# EAGLE design board (EAGLE 7.6.0)
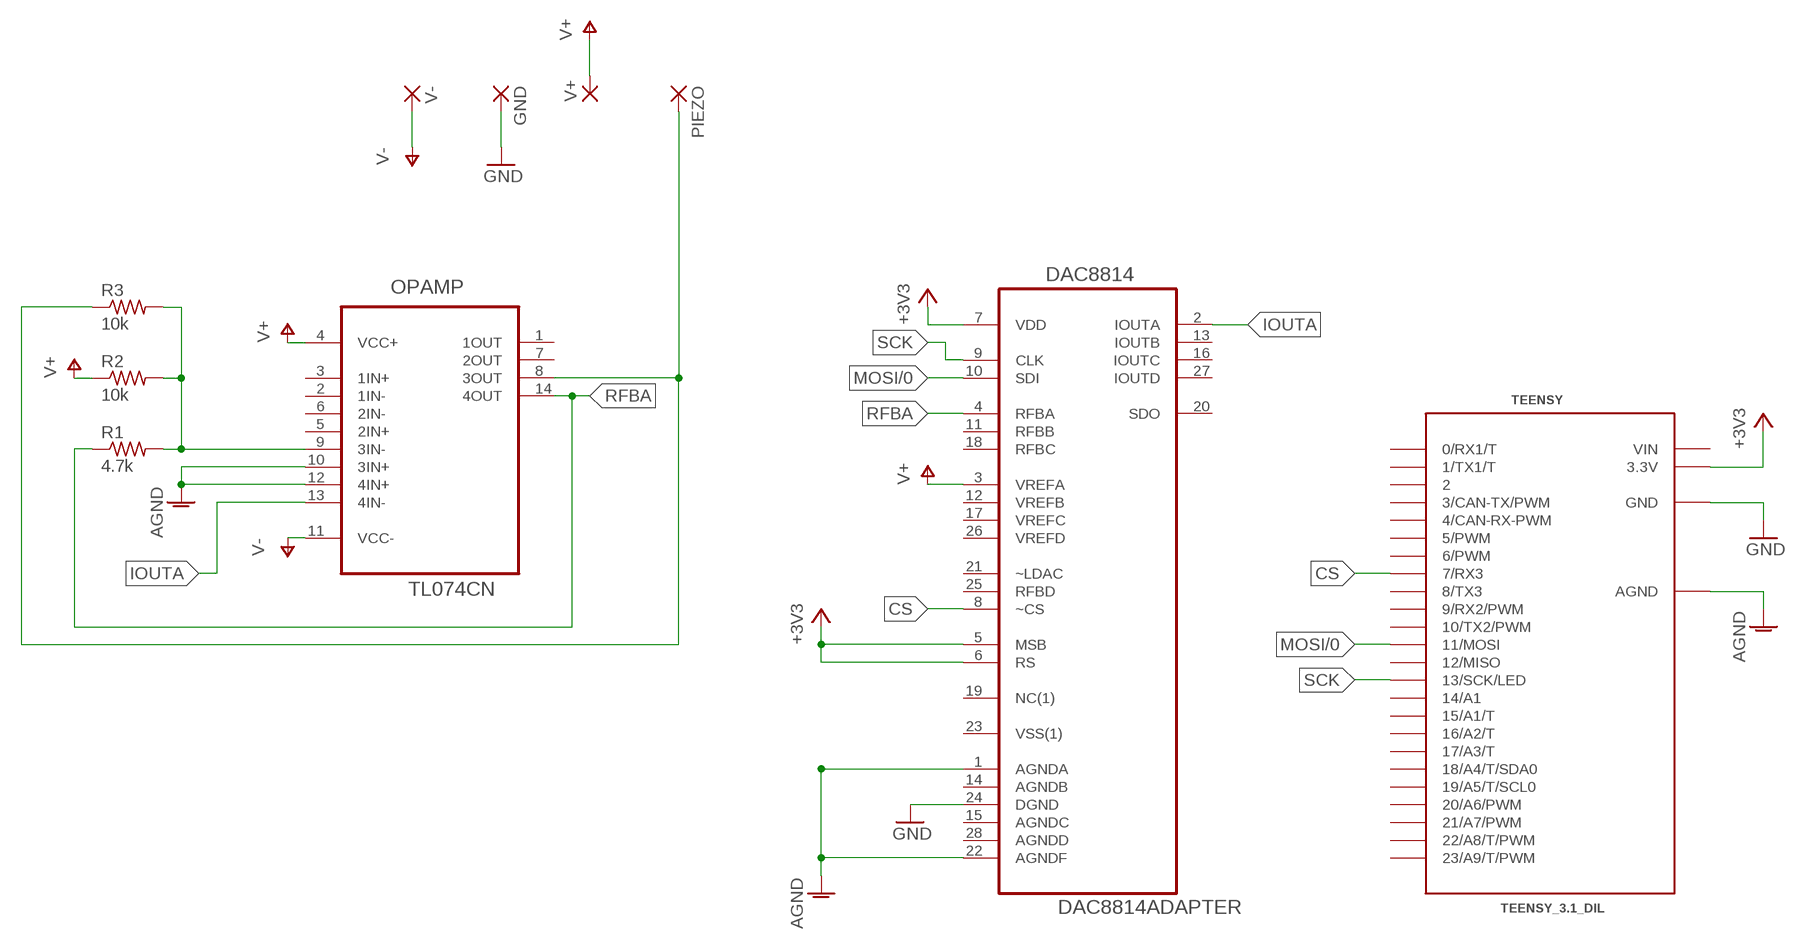
[diagram p0: schematic, sheet 1]

## Parts
DAC8814  DAC8814ADAPTER  [DIL28-6]
GND  1,6/0,8  [1,6/0,8]
OPAMP  TL074CN  [DIP254P762X508-14]
PIEZO  1,6/0,8  [1,6/0,8]
R1  4.7k  R-US_0204/7  [0204/7]
R2  10k  R-US_0204/5  [0204/5]
R3  10k  R-US_0204/5  [0204/5]
TEENSY  TEENSY_3.1_DIL  [TEENSY3-DIL]
V+  1,6/0,8  [1,6/0,8]
V-  1,6/0,8  [1,6/0,8]

## Nets
+3V3: DAC8814.5(MSB) DAC8814.6(RS) DAC8814.7(VDD) TEENSY.3.3V
AGND: DAC8814.1(AGNDA) DAC8814.22(AGNDF) OPAMP.10(3IN+) OPAMP.12(4IN+) TEENSY.AGND
CS: DAC8814.8(~CS) TEENSY.7(7/RX3)
GND: DAC8814.24(DGND) GND.1(P) TEENSY.GND
IOUTA: DAC8814.2(IOUTA) OPAMP.13(4IN-)
MOSI/0: DAC8814.10(SDI) TEENSY.11(11/MOSI)
N$1: OPAMP.9(3IN-) R1.2 R2.2 R3.2
N$5: OPAMP.8(3OUT) PIEZO.1(P) R3.1
RFBA: DAC8814.4(RFBA) OPAMP.14(4OUT) R1.1
SCK: DAC8814.9(CLK) TEENSY.13(13/SCK/LED)
V+: DAC8814.3(VREFA) OPAMP.4(VCC+) R2.1 V+.1(P)
V-: OPAMP.11(VCC-) V-.1(P)
Unconnected: DAC8814.11(RFBB) DAC8814.12(VREFB) DAC8814.13(IOUTB) DAC8814.14(AGNDB) DAC8814.15(AGNDC) DAC8814.16(IOUTC) DAC8814.17(VREFC) DAC8814.18(RFBC) DAC8814.19(NC(1)) DAC8814.20(SDO) DAC8814.21(~LDAC) DAC8814.23(VSS(1)) DAC8814.25(RFBD) DAC8814.26(VREFD) DAC8814.27(IOUTD) DAC8814.28(AGNDD) OPAMP.1(1OUT) OPAMP.2(1IN-) OPAMP.3(1IN+) OPAMP.5(2IN+) OPAMP.6(2IN-) OPAMP.7(2OUT) TEENSY.0(0/RX1/T) TEENSY.1(1/TX1/T) TEENSY.2 TEENSY.3(3/CAN-TX/PWM) TEENSY.4(4/CAN-RX-PWM) TEENSY.5(5/PWM) TEENSY.6(6/PWM) TEENSY.8(8/TX3) TEENSY.9(9/RX2/PWM) TEENSY.10(10/TX2/PWM) TEENSY.12(12/MISO) TEENSY.14/A0(14/A1) TEENSY.15/A1(15/A1/T) TEENSY.16/A2(16/A2/T) TEENSY.17/A3(17/A3/T) TEENSY.18/A4(18/A4/T/SDA0) TEENSY.19/A5(19/A5/T/SCL0) TEENSY.20/A6(20/A6/PWM) TEENSY.21/A7(21/A7/PWM) TEENSY.22/A8(22/A8/T/PWM) TEENSY.23/A9(23/A9/T/PWM)

## Power pins joined to a net without a drawn wire
VIN: TEENSY.VIN

## Library data of the parts
DAC8814 = board:DAC8814ADAPTER: Digital-to-Analog Converter on DIL28 adapter board. Based on components: ic-package.lbr/DIL28 element14/Texas Instruments_By_element14_Batch_1.lbr/DAC8814IBDBT
GND PIEZO V+ V- = wirepad:1,6/0,8: THROUGH-HOLE PAD
OPAMP = Texas Instruments_By_element14_Batch_1:TL074CN: LOW-NOISE JFET-INPUT OPERATIONAL AMPLIFIERS; MPN: TL074CN; OC_FARNELL: 9755934; OC_NEWARK: 60K6990; PACKAGE: PDIP-14; SUPPLIER: Texas Instruments
R1-R3 = resistor:R-US_: RESISTOR, American symbol
TEENSY = Teensy_3_and_LC_Series_Boards_v1.1:TEENSY_3.1_DIL: Teensy 3.1 or 3.2 in a DIL Layout.

## Board
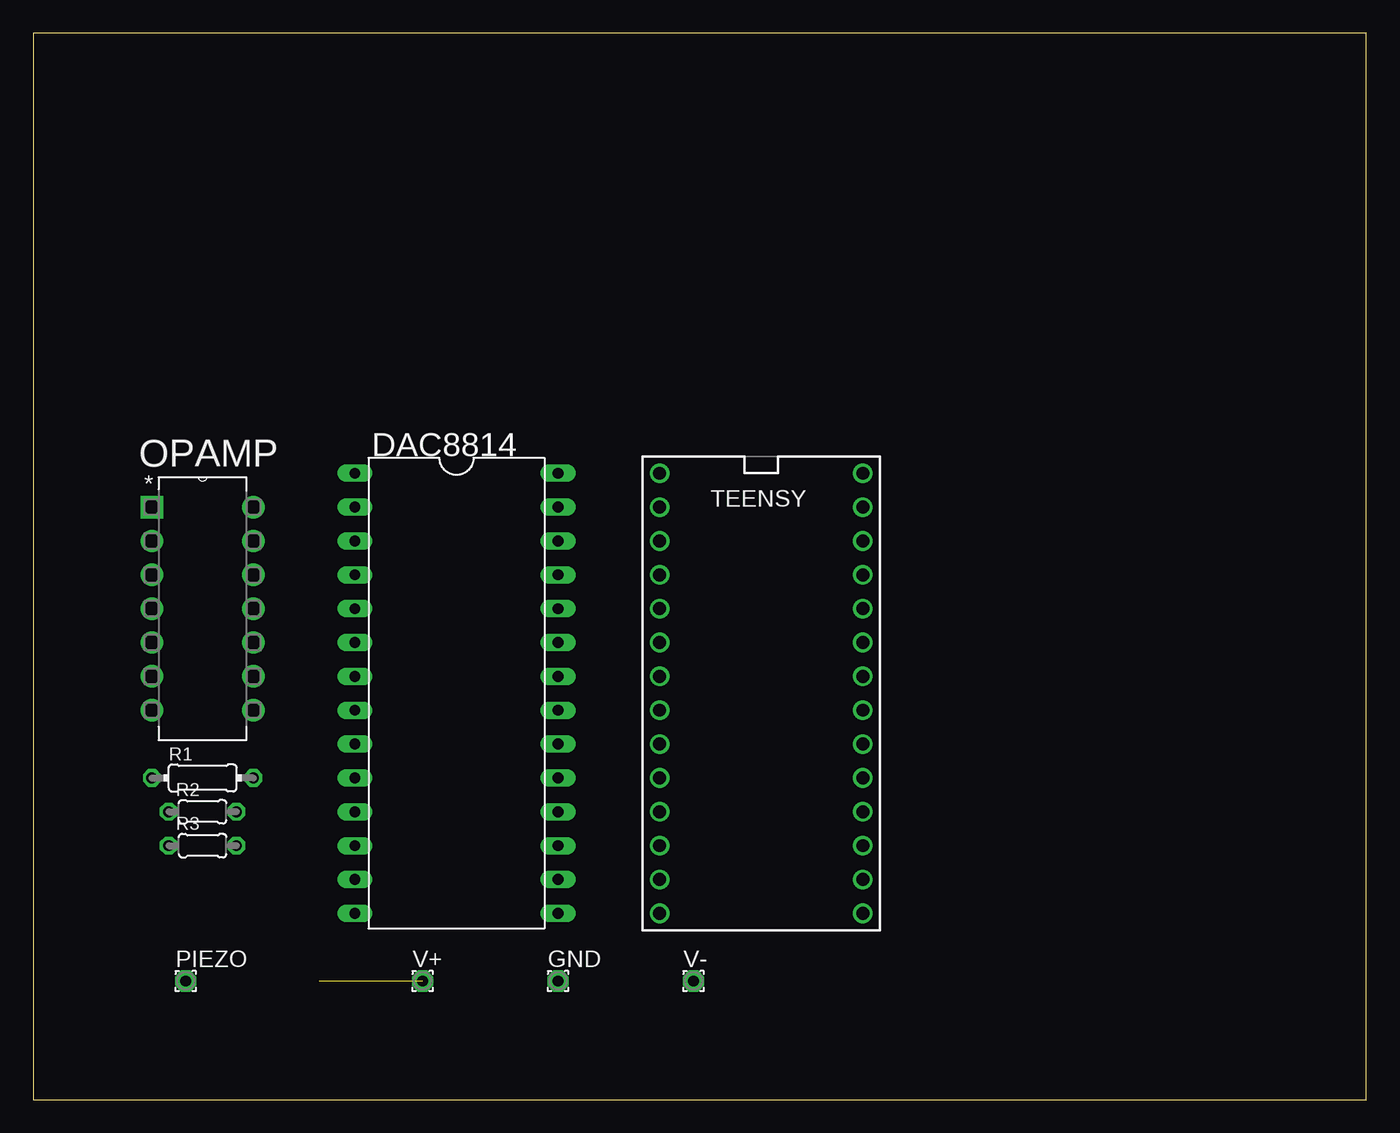
[diagram p1: board, top side]
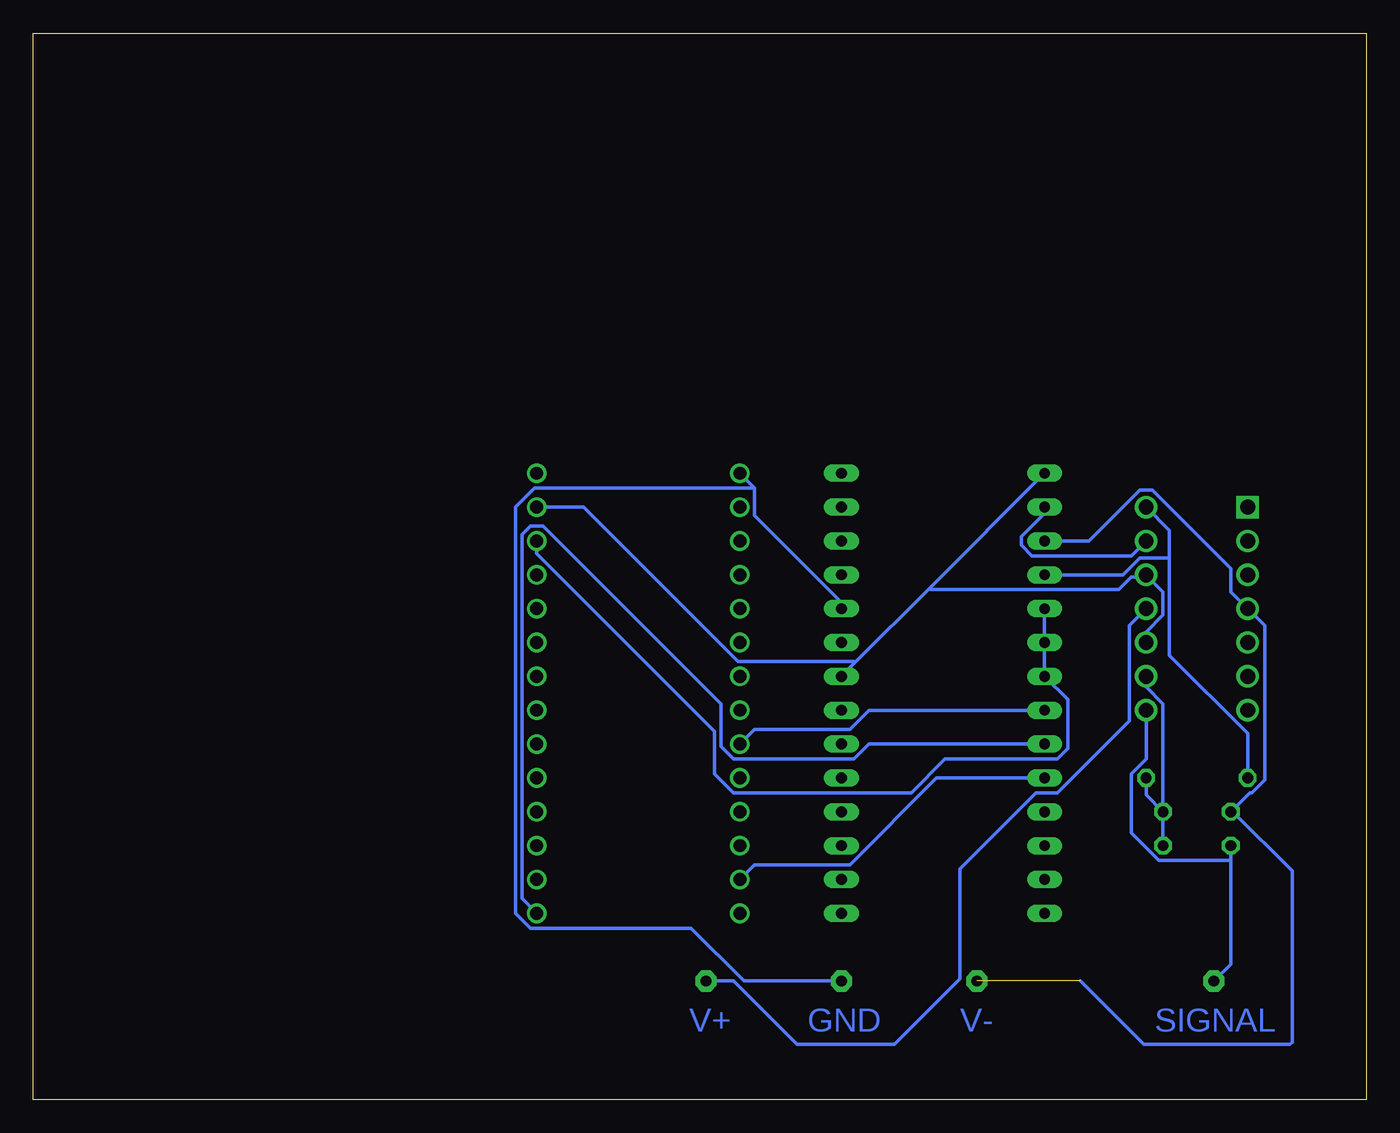
[diagram p2: board, bottom side, seen from below]

Size 100 x 80 mm. Coordinates in mm from the lower left corner, seen from the top.
Outline: 0,0 100,0 100,80 0,80 0,0
Copper layers (1*16): Top 0.035mm / dielectric 1.5mm / Bottom 0.035mm
Design rules "default": minimum track width 10mil, minimum drill 24mil, track to track 8mil, track to pad 8mil, pad to pad 8mil, via to via 8mil, smd to smd 8mil, copper to edge 40mil, drill to drill 8mil, minimum pad ring 10mil, minimum via ring 8mil, stop-mask expansion 4mil, vias tented up to drill 0mil, thermal gap 10mil

### Footprints (pad centres in the part's own frame; a part is rotated, then mirrored left to right if it is on the bottom)
DIL28-6 = drill 0.813 long: 1 -16.51,-7.62; 2 -13.97,-7.62; 3 -11.43,-7.62; 4 -8.89,-7.62; 5 -6.35,-7.62; 6 -3.81,-7.62; 7 -1.27,-7.62; 8 1.27,-7.62; 9 3.81,-7.62; 10 6.35,-7.62; 11 8.89,-7.62; 12 11.43,-7.62; 13 13.97,-7.62; 14 16.51,-7.62; 15 16.51,7.62; 16 13.97,7.62; 17 11.43,7.62; 18 8.89,7.62; 19 6.35,7.62; 20 3.81,7.62; 21 1.27,7.62; 22 -1.27,7.62; 23 -3.81,7.62; 24 -6.35,7.62; 25 -8.89,7.62; 26 -11.43,7.62; 27 -13.97,7.62; 28 -16.51,7.62
1,6/0,8 = drill 0.813 pad 1.6 octagon: 1 0,0
DIP254P762X508-14 = drill 1.118 square: 1 -7.62,15.24 | drill 1.118: 2 -7.62,12.7; 3 -7.62,10.16; 4 -7.62,7.62; 5 -7.62,5.08; 6 -7.62,2.54; 7 -7.62,0; 8 0,0; 9 0,2.54; 10 0,5.08; 11 0,7.62; 12 0,10.16; 13 0,12.7; 14 0,15.24
0204/7 = drill 0.813 octagon: 1 -3.81,0; 2 3.81,0
0204/5 = drill 0.813 octagon: 1 -2.54,0; 2 2.54,0
TEENSY3-DIL = drill 0.965: 0 -7.62,13.97; 1 -7.62,11.43; 2 -7.62,8.89; 3 -7.62,6.35; 3.3V 7.62,11.43; 4 -7.62,3.81; 5 -7.62,1.27; 6 -7.62,-1.27; 7 -7.62,-3.81; 8 -7.62,-6.35; 9 -7.62,-8.89; 10 -7.62,-11.43; 11 -7.62,-13.97; 12 -7.62,-16.51; 13 7.62,-16.51; 14/A0 7.62,-13.97; 15/A1 7.62,-11.43; 16/A2 7.62,-8.89; 17/A3 7.62,-6.35; 18/A4 7.62,-3.81; 19/A5 7.62,-1.27; 20/A6 7.62,1.27; 21/A7 7.62,3.81; 22/A8 7.62,6.35; 23/A9 7.62,8.89; AGND 7.62,13.97; GND -7.62,16.51; VIN 7.62,16.51

### Placement (x,y rotation side)
DAC8814  31.75,30.48 270 top
GND  39.37,8.89 0 top
OPAMP  16.51,29.21 0 top
PIEZO  11.43,8.89 0 top
R1  12.7,24.13 0 top
R2  12.7,21.59 0 top
R3  12.7,19.05 0 top
TEENSY  54.61,30.48 0 top
V+  29.21,8.89 0 top
V-  49.53,8.89 0 top

### Tracks (layer width: path | path; a pad name or v marks a point on that pad's centre or on a via)
+3V3
  Bottom 0.254: DAC8814.5 DAC8814.6 DAC8814.7 22.38,30 22.38,26.35 23.18,25.56 31.59,25.56 34.13,23.02 47.47,23.02 48.9,24.45 48.9,27.62 62.23,40.96 TEENSY.3.3V
AGND
  Bottom 0.254: OPAMP.10 16.51,35.08 15.24,36.35 15.24,38.1 OPAMP.12 16.51,39.21 17.62,39.21 18.57,38.26 32.7,38.26 32.78,38.34 | DAC8814.1 32.78,38.34 | 32.78,38.34 38.34,32.78 | 38.34,32.78 DAC8814.22 | TEENSY.AGND 58.74,44.45 47.15,32.86 38.42,32.86 38.34,32.78
CS
  Bottom 0.254: DAC8814.8 37.31,29.21 38.73,27.78 45.88,27.78 TEENSY.7
GND
  Bottom 0.254: DAC8814.24 39.37,37.31 45.88,43.81 45.88,45.88 45.96,45.96 | TEENSY.GND 45.96,45.96 | GND.1 46.67,8.89 50.64,12.86 62.71,12.86 63.82,13.97 63.82,44.45 62.39,45.88 46.04,45.88 45.96,45.96
IOUTA
  Bottom 0.254: DAC8814.2 24.13,43.97 25.88,42.23 25.88,41.59 25.08,40.8 17.62,40.8 OPAMP.13
MOSI/0
  Bottom 0.254: DAC8814.10 32.23,24.13 38.73,17.62 45.88,17.62 TEENSY.11
N$1
  Bottom 0.254: R2.2 R3.2 | R1.2 16.51,22.86 R2.2 | OPAMP.9 16.51,30.96 15.24,29.69 R2.2
N$5
  Bottom 0.254: 10.16,17.94 10.16,10.16 PIEZO.1 | 10.16,17.94 R3.1 | OPAMP.8 16.51,25.56 17.62,24.45 17.62,20 15.56,17.94 10.16,17.94
RFBA
  Bottom 0.254: R1.1 8.89,27.46 14.76,33.34 14.76,40.64 | 14.76,40.64 14.76,42.7 OPAMP.14 | DAC8814.4 18.26,39.37 16.99,40.64 14.76,40.64
SCK
  Bottom 0.254: DAC8814.9 37.31,26.67 38.42,25.56 47.47,25.56 48.42,26.51 48.42,29.69 61.75,43.02 62.71,43.02 63.34,42.39 63.34,15.08 TEENSY.13
V+  (1 unrouted)
  Bottom 0.254: DAC8814.3 20.8,41.91 16.99,45.72 16.03,45.72 10.16,39.85 10.16,38.1 OPAMP.4 7.62,35.56 7.62,23.97 8.57,23.02 8.73,23.02 R2.1 10,21.59 5.56,17.14 5.56,4.29 5.71,4.13 16.67,4.13 21.43,8.89
V-
  Bottom 0.254: V-.1 47.47,8.89 42.7,4.13 35.4,4.13 30.48,9.05 30.48,17.3 24.77,23.02 23.18,23.02 17.78,28.42 17.78,35.56 OPAMP.11

### Text on the board
Bottom: SIGNAL | V- | GND | V+